# Altium schematic sheet LED_Monitor.SchDoc: LED Monitor
size Tabloid; Date: 12/20/2022; Engineer: Terry D. Schevker; Revision: 1.0; SheetNumber: 2; SheetTotal: 8
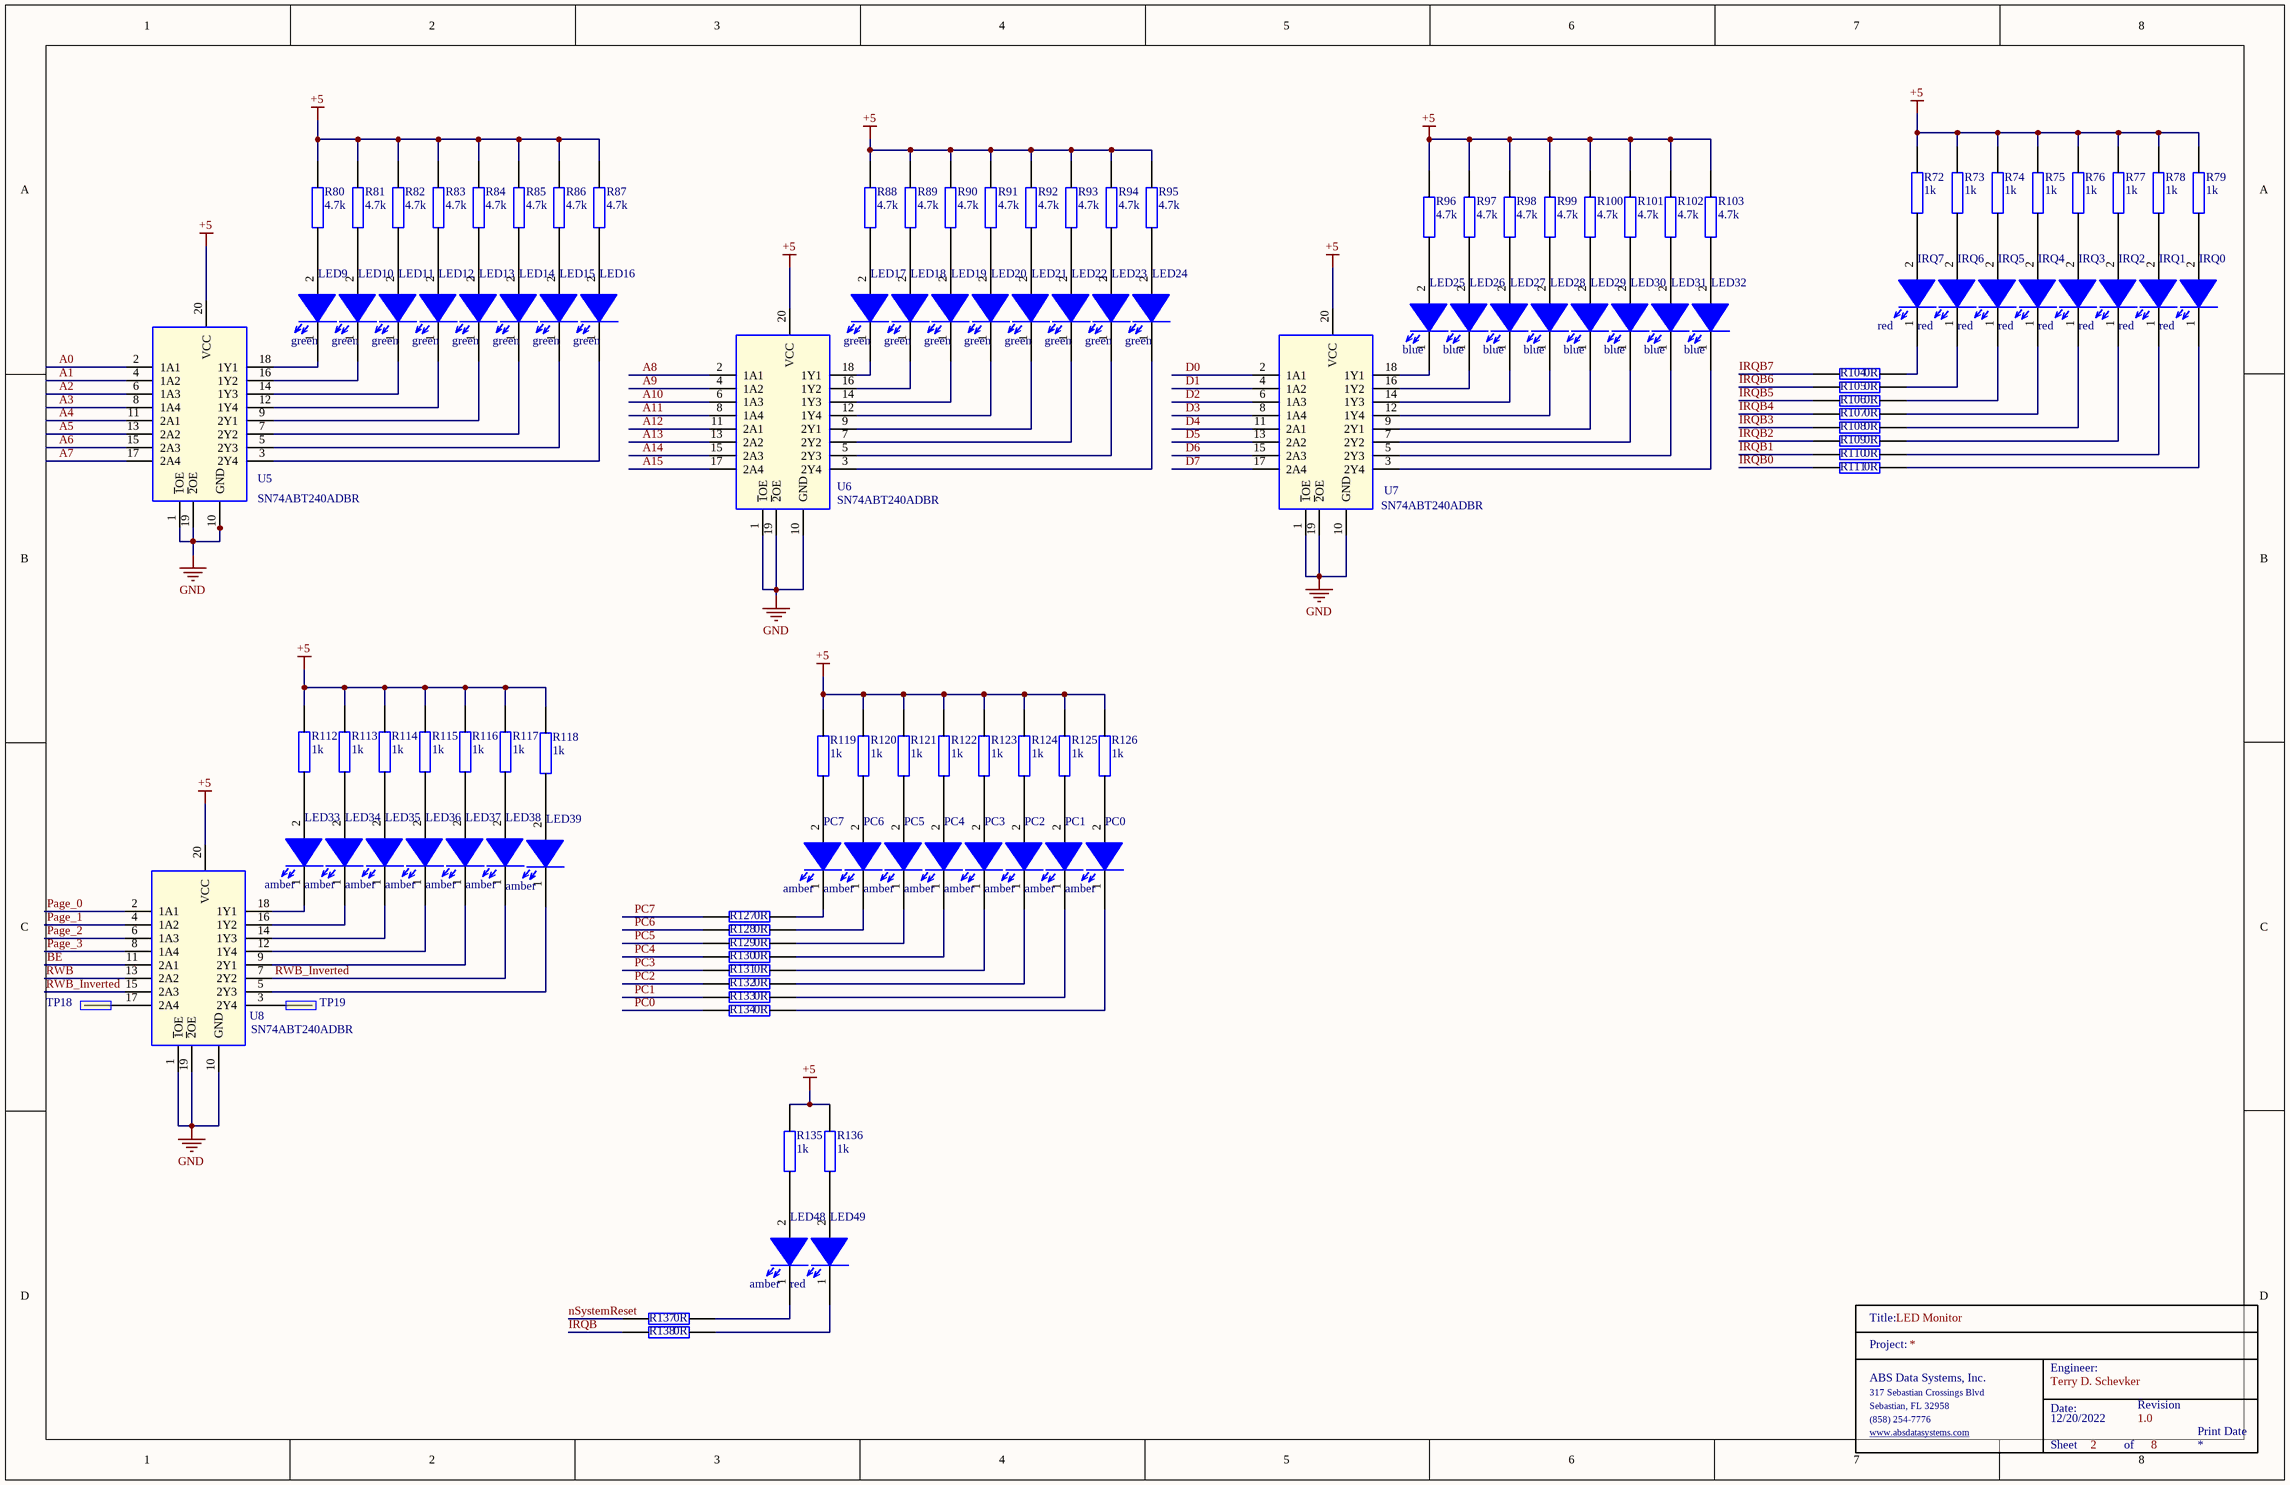
[diagram p0: LED_Monitor.SchDoc]

## Parts
IRQ0  red  [0603_Diode]
IRQ1  red  [0603_Diode]
IRQ2  red  [0603_Diode]
IRQ3  red  [0603_Diode]
IRQ4  red  [0603_Diode]
IRQ5  red  [0603_Diode]
IRQ6  red  [0603_Diode]
IRQ7  red  [0603_Diode]
LED9  green  [0603_Diode]
LED10  green  [0603_Diode]
LED11  green  [0603_Diode]
LED12  green  [0603_Diode]
LED13  green  [0603_Diode]
LED14  green  [0603_Diode]
LED15  green  [0603_Diode]
LED16  green  [0603_Diode]
LED17  green  [0603_Diode]
LED18  green  [0603_Diode]
LED19  green  [0603_Diode]
LED20  green  [0603_Diode]
LED21  green  [0603_Diode]
LED22  green  [0603_Diode]
LED23  green  [0603_Diode]
LED24  green  [0603_Diode]
LED25  blue  [0603_Diode]
LED26  blue  [0603_Diode]
LED27  blue  [0603_Diode]
LED28  blue  [0603_Diode]
LED29  blue  [0603_Diode]
LED30  blue  [0603_Diode]
LED31  blue  [0603_Diode]
LED32  blue  [0603_Diode]
LED33  amber  [0603_Diode]
LED34  amber  [0603_Diode]
LED35  amber  [0603_Diode]
LED36  amber  [0603_Diode]
LED37  amber  [0603_Diode]
LED38  amber  [0603_Diode]
LED39  amber  [0603_Diode]
LED48  amber  [0603_Diode]
LED49  red  [0603_Diode]
PC0  amber  [0603_Diode]
PC1  amber  [0603_Diode]
PC2  amber  [0603_Diode]
PC3  amber  [0603_Diode]
PC4  amber  [0603_Diode]
PC5  amber  [0603_Diode]
PC6  amber  [0603_Diode]
PC7  amber  [0603_Diode]
R72  1k  [0603]
R73  1k  [0603]
R74  1k  [0603]
R75  1k  [0603]
R76  1k  [0603]
R77  1k  [0603]
R78  1k  [0603]
R79  1k  [0603]
R80  4.7k  [0603]
R81  4.7k  [0603]
R82  4.7k  [0603]
R83  4.7k  [0603]
R84  4.7k  [0603]
R85  4.7k  [0603]
R86  4.7k  [0603]
R87  4.7k  [0603]
R88  4.7k  [0603]
R89  4.7k  [0603]
R90  4.7k  [0603]
R91  4.7k  [0603]
R92  4.7k  [0603]
R93  4.7k  [0603]
R94  4.7k  [0603]
R95  4.7k  [0603]
R96  4.7k  [0603]
R97  4.7k  [0603]
R98  4.7k  [0603]
R99  4.7k  [0603]
R100  4.7k  [0603]
R101  4.7k  [0603]
R102  4.7k  [0603]
R103  4.7k  [0603]
R104  0R  [0603]
R105  0R  [0603]
R106  0R  [0603]
R107  0R  [0603]
R108  0R  [0603]
R109  0R  [0603]
R110  0R  [0603]
R111  0R  [0603]
R112  1k  [0603]
R113  1k  [0603]
R114  1k  [0603]
R115  1k  [0603]
R116  1k  [0603]
R117  1k  [0603]
R118  1k  [0603]
R119  1k  [0603]
R120  1k  [0603]
R121  1k  [0603]
R122  1k  [0603]
R123  1k  [0603]
R124  1k  [0603]
R125  1k  [0603]
R126  1k  [0603]
R127  0R  [0603]
R128  0R  [0603]
R129  0R  [0603]
R130  0R  [0603]
R131  0R  [0603]
R132  0R  [0603]
R133  0R  [0603]
R134  0R  [0603]
R135  1k  [0603]
R136  1k  [0603]
R137  0R  [0603]
R138  0R  [0603]
TitleBlock_2  TitleBlock  (value not drawn)  (graphical)
TP18  TP  [TP]  (value not drawn)
TP19  TP  [TP]  (value not drawn)
U5  SN74ABT240ADBR  [SOP65P780X200-20N]
U6  SN74ABT240ADBR  [SOP65P780X200-20N]
U7  SN74ABT240ADBR  [SOP65P780X200-20N]
U8  SN74ABT240ADBR  [SOP65P780X200-20N]

## Nets
+5: R72.1 R73.1 R74.1 R75.1 R76.1 R77.1 R78.1 R79.1 R80.2 R81.2 R82.2 R83.2 R84.2 R85.2 R86.2 R87.2 R88.2 R89.2 R90.2 R91.2 R92.2 R93.2 R94.2 R95.2 R96.1 R97.1 R98.1 R99.1 R100.1 R101.1 R102.1 R103.1 R112.1 R113.1 R114.1 R115.1 R116.1 R117.1 R118.1 R119.1 R120.1 R121.1 R122.1 R123.1 R124.1 R125.1 R126.1 R135.1 R136.1 U5.20(VCC) U6.20(VCC) U7.20(VCC) U8.20(VCC)
GND: U5.1(~{1}OE) U5.10(GND) U5.19(~{2}OE) U6.1(~{1}OE) U6.10(GND) U6.19(~{2}OE) U7.1(~{1}OE) U7.10(GND) U7.19(~{2}OE) U8.1(~{1}OE) U8.10(GND) U8.19(~{2}OE)
A0: U5.2(1A1)
A1: U5.4(1A2)
A2: U5.6(1A3)
A3: U5.8(1A4)
A4: U5.11(2A1)
A5: U5.13(2A2)
A6: U5.15(2A3)
A7: U5.17(2A4)
A8: U6.2(1A1)
A9: U6.4(1A2)
A10: U6.6(1A3)
A11: U6.8(1A4)
A12: U6.11(2A1)
A13: U6.13(2A2)
A14: U6.15(2A3)
A15: U6.17(2A4)
BE: U8.11(2A1)
D0: U7.2(1A1)
D1: U7.4(1A2)
D2: U7.6(1A3)
D3: U7.8(1A4)
D4: U7.11(2A1)
D5: U7.13(2A2)
D6: U7.15(2A3)
D7: U7.17(2A4)
IRQB: R138.1
IRQB0: R111.1
IRQB1: R110.1
IRQB2: R109.1
IRQB3: R108.1
IRQB4: R107.1
IRQB5: R106.1
IRQB6: R105.1
IRQB7: R104.1
nSystemReset: R137.1
Page_0: U8.2(1A1)
Page_1: U8.4(1A2)
Page_2: U8.6(1A3)
Page_3: U8.8(1A4)
PC0: R134.1
PC1: R133.1
PC2: R132.1
PC3: R131.1
PC4: R130.1
PC5: R129.1
PC6: R128.1
PC7: R127.1
RWB: U8.13(2A2)
RWB_Inverted: LED38.1(K) U8.7(2Y2) U8.15(2A3)
NetIRQ0_1: IRQ0.1(K) R111.2
NetIRQ0_2: IRQ0.2(A) R79.2
NetIRQ1_1: IRQ1.1(K) R110.2
NetIRQ1_2: IRQ1.2(A) R78.2
NetIRQ2_1: IRQ2.1(K) R109.2
NetIRQ2_2: IRQ2.2(A) R77.2
NetIRQ3_1: IRQ3.1(K) R108.2
NetIRQ3_2: IRQ3.2(A) R76.2
NetIRQ4_1: IRQ4.1(K) R107.2
NetIRQ4_2: IRQ4.2(A) R75.2
NetIRQ5_1: IRQ5.1(K) R106.2
NetIRQ5_2: IRQ5.2(A) R74.2
NetIRQ6_1: IRQ6.1(K) R105.2
NetIRQ6_2: IRQ6.2(A) R73.2
NetIRQ7_1: IRQ7.1(K) R104.2
NetIRQ7_2: IRQ7.2(A) R72.2
NetLED9_1: LED9.1(K) U5.18(1Y1)
NetLED9_2: LED9.2(A) R80.1
NetLED10_1: LED10.1(K) U5.16(1Y2)
NetLED10_2: LED10.2(A) R81.1
NetLED11_1: LED11.1(K) U5.14(1Y3)
NetLED11_2: LED11.2(A) R82.1
NetLED12_1: LED12.1(K) U5.12(1Y4)
NetLED12_2: LED12.2(A) R83.1
NetLED13_1: LED13.1(K) U5.9(2Y1)
NetLED13_2: LED13.2(A) R84.1
NetLED14_1: LED14.1(K) U5.7(2Y2)
NetLED14_2: LED14.2(A) R85.1
NetLED15_1: LED15.1(K) U5.5(2Y3)
NetLED15_2: LED15.2(A) R86.1
NetLED16_1: LED16.1(K) U5.3(2Y4)
NetLED16_2: LED16.2(A) R87.1
NetLED17_1: LED17.1(K) U6.18(1Y1)
NetLED17_2: LED17.2(A) R88.1
NetLED18_1: LED18.1(K) U6.16(1Y2)
NetLED18_2: LED18.2(A) R89.1
NetLED19_1: LED19.1(K) U6.14(1Y3)
NetLED19_2: LED19.2(A) R90.1
NetLED20_1: LED20.1(K) U6.12(1Y4)
NetLED20_2: LED20.2(A) R91.1
NetLED21_1: LED21.1(K) U6.9(2Y1)
NetLED21_2: LED21.2(A) R92.1
NetLED22_1: LED22.1(K) U6.7(2Y2)
NetLED22_2: LED22.2(A) R93.1
NetLED23_1: LED23.1(K) U6.5(2Y3)
NetLED23_2: LED23.2(A) R94.1
NetLED24_1: LED24.1(K) U6.3(2Y4)
NetLED24_2: LED24.2(A) R95.1
NetLED25_1: LED25.1(K) U7.18(1Y1)
NetLED25_2: LED25.2(A) R96.2
NetLED26_1: LED26.1(K) U7.16(1Y2)
NetLED26_2: LED26.2(A) R97.2
NetLED27_1: LED27.1(K) U7.14(1Y3)
NetLED27_2: LED27.2(A) R98.2
NetLED28_1: LED28.1(K) U7.12(1Y4)
NetLED28_2: LED28.2(A) R99.2
NetLED29_1: LED29.1(K) U7.9(2Y1)
NetLED29_2: LED29.2(A) R100.2
NetLED30_1: LED30.1(K) U7.7(2Y2)
NetLED30_2: LED30.2(A) R101.2
NetLED31_1: LED31.1(K) U7.5(2Y3)
NetLED31_2: LED31.2(A) R102.2
NetLED32_1: LED32.1(K) U7.3(2Y4)
NetLED32_2: LED32.2(A) R103.2
NetLED33_1: LED33.1(K) U8.18(1Y1)
NetLED33_2: LED33.2(A) R112.2
NetLED34_1: LED34.1(K) U8.16(1Y2)
NetLED34_2: LED34.2(A) R113.2
NetLED35_1: LED35.1(K) U8.14(1Y3)
NetLED35_2: LED35.2(A) R114.2
NetLED36_1: LED36.1(K) U8.12(1Y4)
NetLED36_2: LED36.2(A) R115.2
NetLED37_1: LED37.1(K) U8.9(2Y1)
NetLED37_2: LED37.2(A) R116.2
NetLED38_2: LED38.2(A) R117.2
NetLED39_1: LED39.1(K) U8.5(2Y3)
NetLED39_2: LED39.2(A) R118.2
NetLED48_1: LED48.1(K) R137.2
NetLED48_2: LED48.2(A) R135.2
NetLED49_1: LED49.1(K) R138.2
NetLED49_2: LED49.2(A) R136.2
NetPC0_1: PC0.1(K) R134.2
NetPC0_2: PC0.2(A) R126.2
NetPC1_1: PC1.1(K) R133.2
NetPC1_2: PC1.2(A) R125.2
NetPC2_1: PC2.1(K) R132.2
NetPC2_2: PC2.2(A) R124.2
NetPC3_1: PC3.1(K) R131.2
NetPC3_2: PC3.2(A) R123.2
NetPC4_1: PC4.1(K) R130.2
NetPC4_2: PC4.2(A) R122.2
NetPC5_1: PC5.1(K) R129.2
NetPC5_2: PC5.2(A) R121.2
NetPC6_1: PC6.1(K) R128.2
NetPC6_2: PC6.2(A) R120.2
NetPC7_1: PC7.1(K) R127.2
NetPC7_2: PC7.2(A) R119.2
NetTP18_1: TP18.1 U8.17(2A4)
NetTP19_1: TP19.1 U8.3(2Y4)

## Notes on the sheet
- Print Date
- (in symbol TitleBlock) Title:; Project:; Engineer:; ABS Data Systems, Inc.; 317 Sebastian Crossings Blvd; Sebastian, FL 32958; Date:; Revision; (858) 254-7776; www.absdatasystems.com; Sheet; of

## Library data of the parts
IRQ0-IRQ7 = 150060RS75000: Wurth Elektronik 0603 red; Manufacturer: Wurth Electronics; Manufacturer Part Number: 150060GS75000; Wavelength: 520nm; Viewing Angle: 140°; Lens Style: Clear,Rectangular; Luminous Intensity: 430mcd; Forward Current: 30mA; Forward Voltage: 3.2V; Test Current: 20mA; Supplier 1: Digi-Key; RoHS: Yes; Category: LEDs; Stock 1: 71509; Pricing 1: 1=0.14000, 50=0.13300, 100=0.11400, 500=0.09900 (USD); Mount: Surface Mount; Case/Package: 0603; Color: Green; Case Code (Metric): 1608; Case Code (Imperial): 0603; Min Operating Temperature: -40°C; Max Operating Temperature: 85°C; Package Quantity: 4000; Packaging: Tape and Reel; Dominant Wavelength: 520nm; Length: 1.6mm; Width: 0.8mm; Height: 0.7mm; REACH SVHC: Unknown; Lead Free: Lead Free; ComponentLink1URL: https://datasheet.ciiva.com/29562/150060gs75000-29562868.pdf?src-supplier=Digi-Key; ComponentLink1Description: https://datasheet.ciiva.com/29562/150060gs75000-29562868.pdf?src-supplier=Digi-Key; ComponentLink2URL: https://datasheet.ciiva.com/29279/759427-da-01-en-chipled-0603-w-kl-gruen-150060gs75000-29279201.pdf?src-supplier=Conrad; ComponentLink2Description: https://datasheet.ciiva.com/29279/759427-da-01-en-chipled-0603-w-kl-gruen-150060gs75000-29279201.pdf?src-supplier=Conrad; ComponentLink3URL: https://datasheet.ciiva.com/29562/150060gs75000-29562869.pdf?src-supplier=Digi-Key; ComponentLink3Description: https://datasheet.ciiva.com/29562/150060gs75000-29562869.pdf?src-supplier=Digi-Key; ComponentLink4URL: https://datasheet.ciiva.com/29562/150060gs75000-29562870.pdf?src-supplier=Digi-Key; ComponentLink4Description: https://datasheet.ciiva.com/29562/150060gs75000-29562870.pdf?src-supplier=Digi-Key
LED9-LED24 = 150060GS75000: Wurth Elektronik 0603 green; Manufacturer: Wurth Electronics; Wavelength: 520nm; Viewing Angle: 140°; Lens Style: Clear,Rectangular; Luminous Intensity: 430mcd; Forward Current: 30mA; Forward Voltage: 3.2V; Test Current: 20mA; Supplier 1: Digi-Key; Manufacturer Part Number: 150060GS75000; RoHS: Yes; Category: LEDs; Stock 1: 71509; Pricing 1: 1=0.14000, 50=0.13300, 100=0.11400, 500=0.09900 (USD); Mount: Surface Mount; Case/Package: 0603; Color: Green; Case Code (Metric): 1608; Case Code (Imperial): 0603; Min Operating Temperature: -40°C; Max Operating Temperature: 85°C; Package Quantity: 4000; Packaging: Tape and Reel; Dominant Wavelength: 520nm; Length: 1.6mm; Width: 0.8mm; Height: 0.7mm; REACH SVHC: Unknown; Lead Free: Lead Free; ComponentLink1URL: https://datasheet.ciiva.com/29562/150060gs75000-29562868.pdf?src-supplier=Digi-Key; ComponentLink1Description: https://datasheet.ciiva.com/29562/150060gs75000-29562868.pdf?src-supplier=Digi-Key; ComponentLink2URL: https://datasheet.ciiva.com/29279/759427-da-01-en-chipled-0603-w-kl-gruen-150060gs75000-29279201.pdf?src-supplier=Conrad; ComponentLink2Description: https://datasheet.ciiva.com/29279/759427-da-01-en-chipled-0603-w-kl-gruen-150060gs75000-29279201.pdf?src-supplier=Conrad; ComponentLink3URL: https://datasheet.ciiva.com/29562/150060gs75000-29562869.pdf?src-supplier=Digi-Key; ComponentLink3Description: https://datasheet.ciiva.com/29562/150060gs75000-29562869.pdf?src-supplier=Digi-Key; ComponentLink4URL: https://datasheet.ciiva.com/29562/150060gs75000-29562870.pdf?src-supplier=Digi-Key; ComponentLink4Description: https://datasheet.ciiva.com/29562/150060gs75000-29562870.pdf?src-supplier=Digi-Key
LED25-LED32 = 150060BS75000: Wurth Elektronik 0603 blue; Manufacturer: Wurth Electronics; Manufacturer Part Number: 150060GS75000; Color: Green; Wavelength: 520nm; Viewing Angle: 140°; Lens Style: Clear,Rectangular; Luminous Intensity: 430mcd; Forward Current: 30mA; Forward Voltage: 3.2V; Test Current: 20mA; Supplier 1: Digi-Key; RoHS: Yes; Category: LEDs; Stock 1: 71509; Pricing 1: 1=0.14000, 50=0.13300, 100=0.11400, 500=0.09900 (USD); Mount: Surface Mount; Case/Package: 0603; Case Code (Metric): 1608; Case Code (Imperial): 0603; Min Operating Temperature: -40°C; Max Operating Temperature: 85°C; Package Quantity: 4000; Packaging: Tape and Reel; Dominant Wavelength: 520nm; Length: 1.6mm; Width: 0.8mm; Height: 0.7mm; REACH SVHC: Unknown; Lead Free: Lead Free; ComponentLink1URL: https://datasheet.ciiva.com/29562/150060gs75000-29562868.pdf?src-supplier=Digi-Key; ComponentLink1Description: https://datasheet.ciiva.com/29562/150060gs75000-29562868.pdf?src-supplier=Digi-Key; ComponentLink2URL: https://datasheet.ciiva.com/29279/759427-da-01-en-chipled-0603-w-kl-gruen-150060gs75000-29279201.pdf?src-supplier=Conrad; ComponentLink2Description: https://datasheet.ciiva.com/29279/759427-da-01-en-chipled-0603-w-kl-gruen-150060gs75000-29279201.pdf?src-supplier=Conrad; ComponentLink3URL: https://datasheet.ciiva.com/29562/150060gs75000-29562869.pdf?src-supplier=Digi-Key; ComponentLink3Description: https://datasheet.ciiva.com/29562/150060gs75000-29562869.pdf?src-supplier=Digi-Key; ComponentLink4URL: https://datasheet.ciiva.com/29562/150060gs75000-29562870.pdf?src-supplier=Digi-Key; ComponentLink4Description: https://datasheet.ciiva.com/29562/150060gs75000-29562870.pdf?src-supplier=Digi-Key
LED33-LED39 LED48 = 150060AS75000: Wurth Elektronik 0603 amber; Manufacturer: Wurth Electronics; Manufacturer Part Number: 150060GS75000; Color: Green; Wavelength: 520nm; Viewing Angle: 140°; Lens Style: Clear,Rectangular; Luminous Intensity: 430mcd; Forward Current: 30mA; Forward Voltage: 3.2V; Test Current: 20mA; Supplier 1: Digi-Key; RoHS: Yes; Category: LEDs; Stock 1: 71509; Pricing 1: 1=0.14000, 50=0.13300, 100=0.11400, 500=0.09900 (USD); Mount: Surface Mount; Case/Package: 0603; Case Code (Metric): 1608; Case Code (Imperial): 0603; Min Operating Temperature: -40°C; Max Operating Temperature: 85°C; Package Quantity: 4000; Packaging: Tape and Reel; Dominant Wavelength: 520nm; Length: 1.6mm; Width: 0.8mm; Height: 0.7mm; REACH SVHC: Unknown; Lead Free: Lead Free; ComponentLink1URL: https://datasheet.ciiva.com/29562/150060gs75000-29562868.pdf?src-supplier=Digi-Key; ComponentLink1Description: https://datasheet.ciiva.com/29562/150060gs75000-29562868.pdf?src-supplier=Digi-Key; ComponentLink2URL: https://datasheet.ciiva.com/29279/759427-da-01-en-chipled-0603-w-kl-gruen-150060gs75000-29279201.pdf?src-supplier=Conrad; ComponentLink2Description: https://datasheet.ciiva.com/29279/759427-da-01-en-chipled-0603-w-kl-gruen-150060gs75000-29279201.pdf?src-supplier=Conrad; ComponentLink3URL: https://datasheet.ciiva.com/29562/150060gs75000-29562869.pdf?src-supplier=Digi-Key; ComponentLink3Description: https://datasheet.ciiva.com/29562/150060gs75000-29562869.pdf?src-supplier=Digi-Key; ComponentLink4URL: https://datasheet.ciiva.com/29562/150060gs75000-29562870.pdf?src-supplier=Digi-Key; ComponentLink4Description: https://datasheet.ciiva.com/29562/150060gs75000-29562870.pdf?src-supplier=Digi-Key
LED49 = 150060RS75000: Wurth Elektronik 0603 red; Manufacturer: Wurth Electronics; Manufacturer Part Number: 150060GS75000; Color: Green; Wavelength: 520nm; Viewing Angle: 140°; Lens Style: Clear,Rectangular; Luminous Intensity: 430mcd; Forward Current: 30mA; Forward Voltage: 3.2V; Test Current: 20mA; Supplier 1: Digi-Key; RoHS: Yes; Category: LEDs; Stock 1: 71509; Pricing 1: 1=0.14000, 50=0.13300, 100=0.11400, 500=0.09900 (USD); Mount: Surface Mount; Case/Package: 0603; Case Code (Metric): 1608; Case Code (Imperial): 0603; Min Operating Temperature: -40°C; Max Operating Temperature: 85°C; Package Quantity: 4000; Packaging: Tape and Reel; Dominant Wavelength: 520nm; Length: 1.6mm; Width: 0.8mm; Height: 0.7mm; REACH SVHC: Unknown; Lead Free: Lead Free; ComponentLink1URL: https://datasheet.ciiva.com/29562/150060gs75000-29562868.pdf?src-supplier=Digi-Key; ComponentLink1Description: https://datasheet.ciiva.com/29562/150060gs75000-29562868.pdf?src-supplier=Digi-Key; ComponentLink2URL: https://datasheet.ciiva.com/29279/759427-da-01-en-chipled-0603-w-kl-gruen-150060gs75000-29279201.pdf?src-supplier=Conrad; ComponentLink2Description: https://datasheet.ciiva.com/29279/759427-da-01-en-chipled-0603-w-kl-gruen-150060gs75000-29279201.pdf?src-supplier=Conrad; ComponentLink3URL: https://datasheet.ciiva.com/29562/150060gs75000-29562869.pdf?src-supplier=Digi-Key; ComponentLink3Description: https://datasheet.ciiva.com/29562/150060gs75000-29562869.pdf?src-supplier=Digi-Key; ComponentLink4URL: https://datasheet.ciiva.com/29562/150060gs75000-29562870.pdf?src-supplier=Digi-Key; ComponentLink4Description: https://datasheet.ciiva.com/29562/150060gs75000-29562870.pdf?src-supplier=Digi-Key
PC0-PC7 = 150060AS75000: Wurth Elektronik 0603 amber; Manufacturer: Wurth Electronics; Manufacturer Part Number: 150060GS75000; Wavelength: 520nm; Viewing Angle: 140°; Lens Style: Clear,Rectangular; Luminous Intensity: 430mcd; Forward Current: 30mA; Forward Voltage: 3.2V; Test Current: 20mA; Supplier 1: Digi-Key; RoHS: Yes; Category: LEDs; Stock 1: 71509; Pricing 1: 1=0.14000, 50=0.13300, 100=0.11400, 500=0.09900 (USD); Mount: Surface Mount; Case/Package: 0603; Color: Green; Case Code (Metric): 1608; Case Code (Imperial): 0603; Min Operating Temperature: -40°C; Max Operating Temperature: 85°C; Package Quantity: 4000; Packaging: Tape and Reel; Dominant Wavelength: 520nm; Length: 1.6mm; Width: 0.8mm; Height: 0.7mm; REACH SVHC: Unknown; Lead Free: Lead Free; ComponentLink1URL: https://datasheet.ciiva.com/29562/150060gs75000-29562868.pdf?src-supplier=Digi-Key; ComponentLink1Description: https://datasheet.ciiva.com/29562/150060gs75000-29562868.pdf?src-supplier=Digi-Key; ComponentLink2URL: https://datasheet.ciiva.com/29279/759427-da-01-en-chipled-0603-w-kl-gruen-150060gs75000-29279201.pdf?src-supplier=Conrad; ComponentLink2Description: https://datasheet.ciiva.com/29279/759427-da-01-en-chipled-0603-w-kl-gruen-150060gs75000-29279201.pdf?src-supplier=Conrad; ComponentLink3URL: https://datasheet.ciiva.com/29562/150060gs75000-29562869.pdf?src-supplier=Digi-Key; ComponentLink3Description: https://datasheet.ciiva.com/29562/150060gs75000-29562869.pdf?src-supplier=Digi-Key; ComponentLink4URL: https://datasheet.ciiva.com/29562/150060gs75000-29562870.pdf?src-supplier=Digi-Key; ComponentLink4Description: https://datasheet.ciiva.com/29562/150060gs75000-29562870.pdf?src-supplier=Digi-Key
R72-R79 R112-R126 R135 R136 = AC0603FR-7W1KL_1: YAGEO 0603 1k ohm; Manufacturer_Name: KEMET; Manufacturer_Part_Number: RC0603JR-070RL; Geometry.Height: 0.55mm; Mouser Part Number: 603-RC0603JR-070RL; Mouser Price/Stock: https://www.mouser.co.uk/ProductDetail/YAGEO/RC0603JR-070RL?qs=2cAdsCoAWRGWyPcuXgGiXQ%3D%3D; Datasheet Link: https://datasheet.datasheetarchive.com/originals/distributors/Datasheets_SAMA/902f9e387b938f871d31120f5fc1d65e.pdf
R80-R103 = RC0603FR-104K7L: YAGEO 0603 4.7k; Manufacturer_Name: KEMET; Manufacturer_Part_Number: RC0603JR-070RL; Geometry.Height: 0.55mm; Mouser Part Number: 603-RC0603JR-070RL; Mouser Price/Stock: https://www.mouser.co.uk/ProductDetail/YAGEO/RC0603JR-070RL?qs=2cAdsCoAWRGWyPcuXgGiXQ%3D%3D; Datasheet Link: https://datasheet.datasheetarchive.com/originals/distributors/Datasheets_SAMA/902f9e387b938f871d31120f5fc1d65e.pdf
R104-R111 R127-R134 R137 R138 = RC0603JR-070RL: YAGEO 0603 0 ohm; Manufacturer_Name: KEMET; Geometry.Height: 0.55mm; Mouser Part Number: 603-RC0603JR-070RL; Mouser Price/Stock: https://www.mouser.co.uk/ProductDetail/YAGEO/RC0603JR-070RL?qs=2cAdsCoAWRGWyPcuXgGiXQ%3D%3D; Manufacturer_Part_Number: RC0603JR-070RL; Datasheet Link: https://datasheet.datasheetarchive.com/originals/distributors/Datasheets_SAMA/902f9e387b938f871d31120f5fc1d65e.pdf
TP18 TP19 = TP: Manufacturer: Samtec; Manufacturer Part Number: TST-105-01-G-D; Number of Contacts: 16; Gender: Male; Connector Type: Male Pin; Pitch: 2.54mm; Row Spacing: 0.1inch; Supplier 1: Digi-Key; RoHS: Yes; Category: Headers and Wire Housings; Stock 1: 227; Pricing 1: 1=2.85000, 10=2.73600, 100=2.28000, 500=1.93800, 1000=1.65300, 5000=1.48200 (USD); Mount: Through Hole; Contact Plating: Gold; Contact Material: Bronze; Housing Material: Polyester; Housing Color: Black; Color: Black; Min Operating Temperature: -55°C; Max Operating Temperature: 125°C; Number of Rows: 2; Termination: Solder; Packaging: Rail/Tube; Orientation: Straight; Number of Positions: 16; Length: 27.94mm; Depth: 9.27mm; Contact Mating Length: 0.25inch; REACH SVHC: No SVHC; ComponentLink1URL: https://datasheet.ciiva.com/739/tst-mkt-739845.pdf?src-supplier=Digi-Key; ComponentLink1Description: https://datasheet.ciiva.com/739/tst-mkt-739845.pdf?src-supplier=Digi-Key; ComponentLink2URL: https://datasheet.ciiva.com/10018/htst-10018510.pdf?src-supplier=Avnet; ComponentLink2Description: https://datasheet.ciiva.com/10018/htst-10018510.pdf?src-supplier=Avnet
U5-U8 = SN74ABT240ADBR: Octal Buffers/Drivers With 3-State Outputs; Manufacturer_Name: Texas Instruments; Geometry.Height: 2mm; Mouser Part Number: 595-SN74ABT240ADBR; Mouser Price/Stock: https://www.mouser.co.uk/ProductDetail/Texas-Instruments/SN74ABT240ADBR?qs=JHHQeKcAU3Dt82k%252BVyiYdw%3D%3D; Manufacturer_Part_Number: SN74ABT240ADBR; Datasheet Link: http://www.ti.com/lit/gpn/sn74abt240a